# EAGLE design O2 (EAGLE 7.2.0)
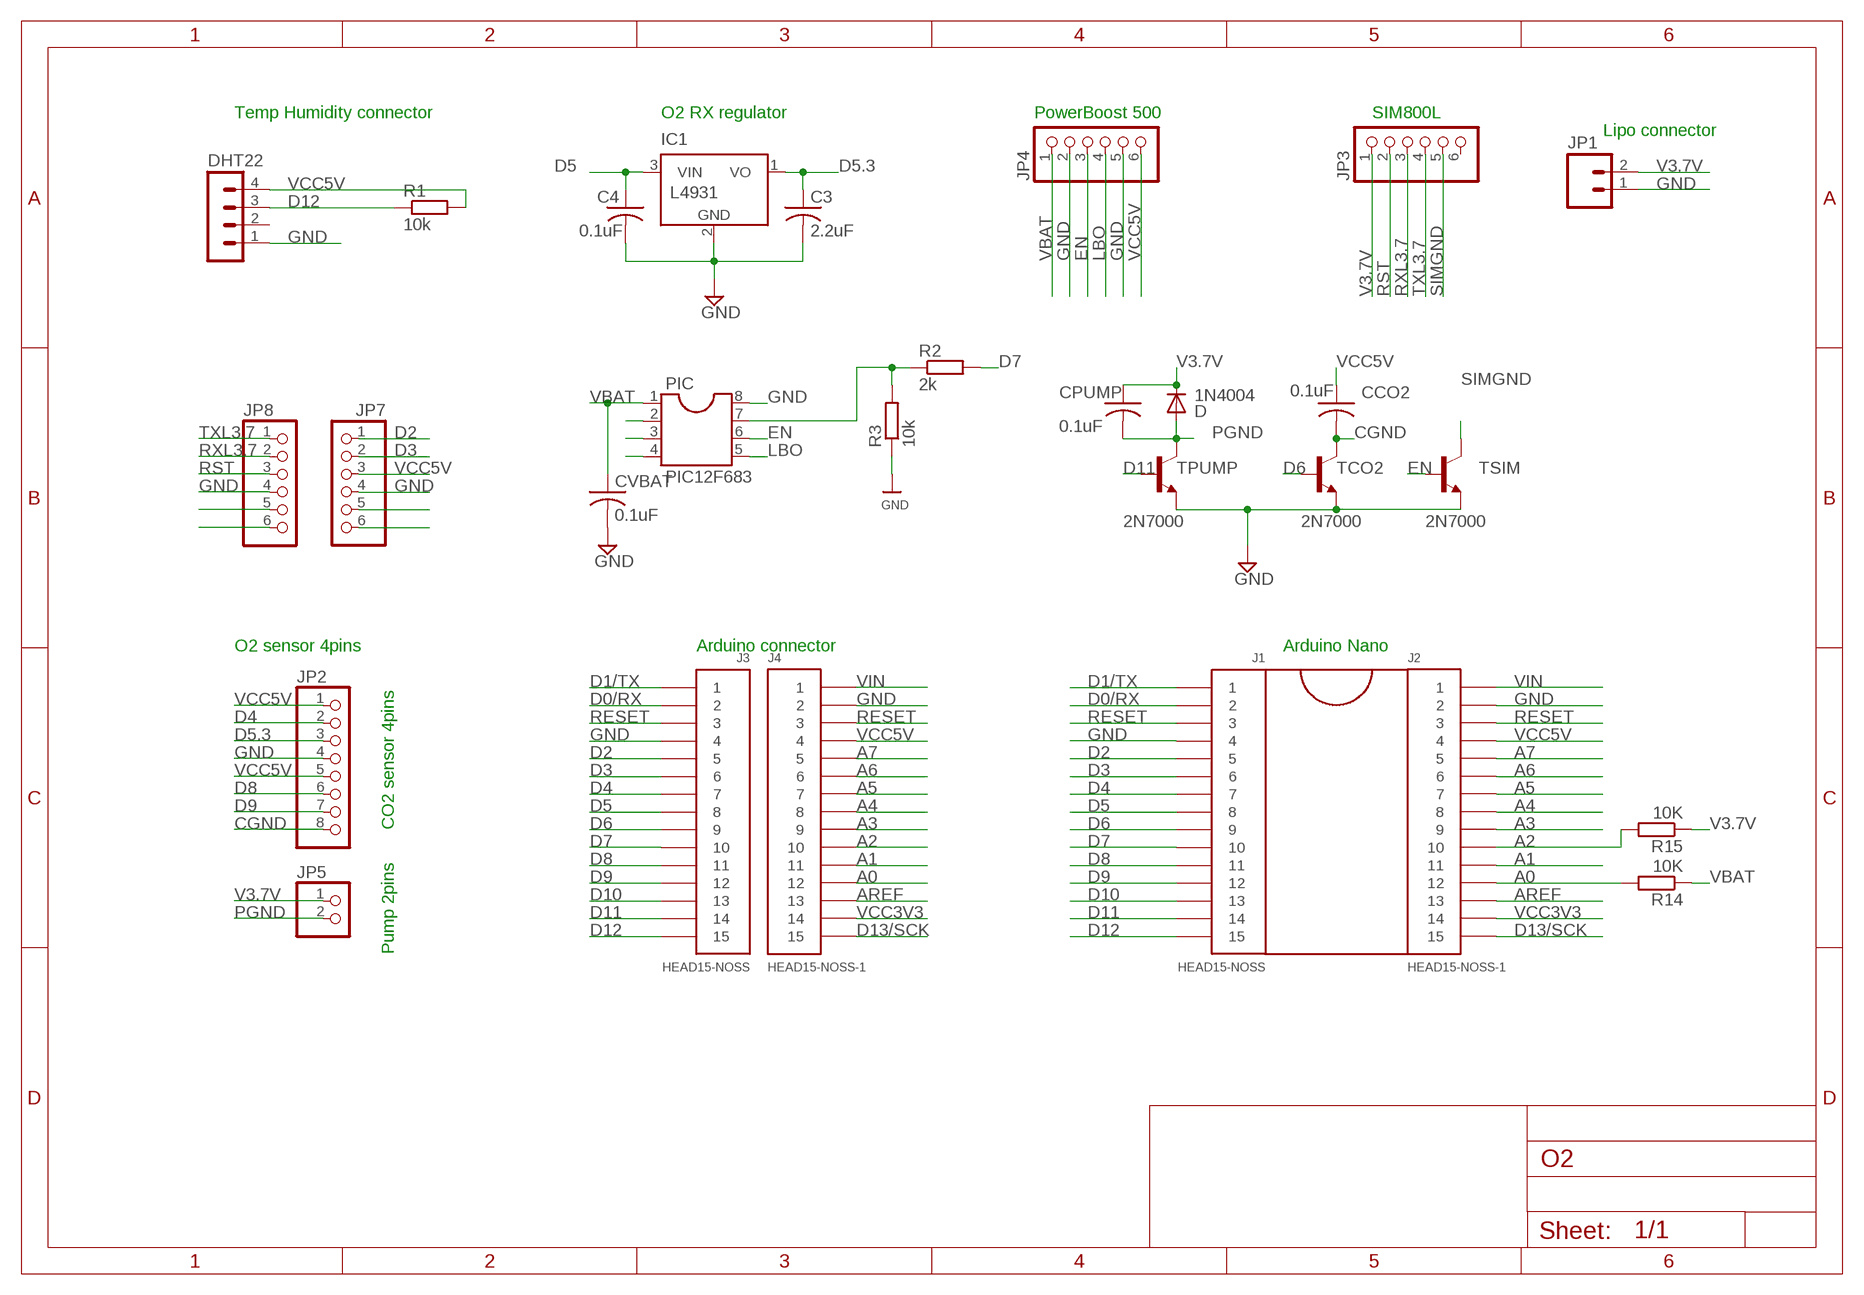
[diagram p0: schematic, sheet 1]

## Parts
C3  2.2uF  C-US025-030X050  [C025-030X050]
C4  0.1uF  C-US025-030X050  [C025-030X050]
CCO2  0.1uF  C-US025-030X050  [C025-030X050]
CPUMP  0.1uF  C-US025-030X050  [C025-030X050]
CVBAT  0.1uF  C-US025-030X050  [C025-030X050]
D  1N4004  [DO41-10]
DHT22  MA04-1  [MA04-1]
IC1  L4931  LM2936Z-3.3  [TO92]
J1  HEAD15-NOSS  [HEAD15-NOSS]
J2  HEAD15-NOSS-1  [HEAD15-NOSS-1]
J3  HEAD15-NOSS  [HEAD15-NOSS]
J4  HEAD15-NOSS-1  [HEAD15-NOSS-1]
JP1  M023.5MM  [SCREWTERMINAL-3.5MM-2]
JP2  PINHD-1X8BIG  [1X08-BIG]
JP3  PINHD-1X6CB  [1X06-CLEANBIG]
JP4  PINHD-1X6CB  [1X06-CLEANBIG]
JP5  PINHD-1X2  [1X02]
JP7  PINHD-1X6CB  [1X06-CLEANBIG]
JP8  PINHD-1X6CB  [1X06-CLEANBIG]
PIC  PIC12F683  DIL8S  [SOCKET-08]
R1  10k  R-EU_0204/5  [0204/5]
R2  2k  R-EU_0204/5  [0204/5]
R3  10k  R-EU_0204/5  [0204/5]
R14  10K  R-EU_0204/5  [0204/5]
R15  10K  R-EU_0204/5  [0204/5]
TCO2  2N7000  2N2222  [TO92-EBC-OVAL]
TPUMP  2N7000  2N2222  [TO92-EBC-OVAL]
TSIM  2N7000  2N2222  [TO92-EBC-OVAL]

## Nets
A0: J2.12 J4.12 R14.2
A1: J2.11 J4.11
A2: J2.10 J4.10 R15.2
A3: J2.9 J4.9
A4: J2.8 J4.8
A5: J2.7 J4.7
A6: J2.6 J4.6
A7: J2.5 J4.5
AREF: J2.13 J4.13
CGND: CCO2.2 JP2.8 TCO2.C
D0/RX: J1.2 J3.2
D1/TX: J1.1 J3.1
D2: J1.5 J3.5 JP7.1
D3: J1.6 J3.6 JP7.2
D4: J1.7 J3.7 JP2.2
D5: C4.1 IC1.3(VIN) J1.8 J3.8
D5.3: C3.1 IC1.1(VO) JP2.3
D6: J1.9 J3.9 TCO2.B
D7: J1.10 J3.10 R2.2
D8: J1.11 J3.11 JP2.6
D9: J1.12 J3.12 JP2.7
D10: J1.13 J3.13
D11: J1.14 J3.14 TPUMP.B
D12: DHT22.3 J1.15 J3.15 R1.1
D13/SCK: J2.15 J4.15
EN: JP4.3 PIC.6 TSIM.B
GND: C3.2 C4.2 CVBAT.2 DHT22.1 IC1.2(GND) J1.4 J2.2 J3.4 J4.2 JP1.1 JP2.4 JP4.2 JP4.5 JP7.4 JP8.4 PIC.8 R3.1 TCO2.E TPUMP.E TSIM.E
LBO: JP4.4 PIC.5
N$3: JP8.5
N$4: JP8.6
N$15: JP7.5
N$16: JP7.6
N$24: PIC.2
N$25: PIC.3
N$26: PIC.4
N$29: PIC.7 R2.1 R3.2
PGND: CPUMP.2 D.A JP5.2 TPUMP.C
RESET: J1.3 J2.3 J3.3 J4.3
RST: JP3.2 JP8.3
RXL3.7: JP3.3 JP8.2
SIMGND: JP3.5 TSIM.C
TXL3.7: JP3.4 JP8.1
V3.7V: CPUMP.1 D.C JP1.2 JP3.1 JP5.1 R15.1
VBAT: CVBAT.1 JP4.1 PIC.1 R14.1
VCC3V3: J2.14 J4.14
VCC5V: CCO2.1 DHT22.4 J2.4 J4.4 JP2.1 JP2.5 JP4.6 JP7.3 R1.2
VIN: J2.1 J4.1
Unconnected: DHT22.2 JP3.6

## Notes on the sheet
- Temp Humidity connector | O2 RX regulator | PowerBoost 500 | SIM800L
- Lipo connector
- O2 sensor 4pins | Arduino connector | Arduino Nano
- CO2 sensor 4pins
- Pump 2pins

## Library data of the parts
C3 C4 CCO2 CPUMP CVBAT = adafruit:C-US: CAPACITOR, American symbol
D = diode:1N4004: DIODE general purpose rectifier, 1 A
DHT22 = con-lstb:MA04-1: PIN HEADER; OC_FARNELL: unknown; OC_NEWARK: unknown
IC1 = national-semiconductor:LM2936?*: Ultra-Low Quiescent Current LDO Voltage Regulator Source: Data sheet <http://www.national.com/ds/LM/LM2936.pdf>; MF: NATIONAL SEMICONDUCTOR; MPN: LM2936Z-3.3/NOPB; OC_FARNELL: 1564641; OC_NEWARK: 41K4532
J1 J3 = MyCON2:HEAD15-NOSS
J2 J4 = MyCON2:HEAD15-NOSS-1
JP1 = SparkFun-Connectors:M02: Standard 2-pin 0.1" header. Use with - straight break away headers ( PRT-00116) - right angle break away headers (PRT-00553) - swiss pins (PRT-00743) - machine pins (PRT-00117) - female headers (PRT-00115) Molex polarized connector foot print use with: PRT-08233 with associated crimp pins and housings. 2.54_SCREWTERM for use with PRT-10571. 3.5mm Screw Terminal footprints for PRT-08084 5mm Screw Terminal footprints for use with PRT-08432; PROD_ID: CONN-08399
JP2 = adafruit:PINHD-1X8: PIN HEADER
JP3 JP4 JP7 JP8 = adafruit:PINHD-1X6: PIN HEADER
JP5 = pinhead:PINHD-1X2: PIN HEADER
PIC = ic-package:DIL8: Dual In Line / Socket
R1-R3 R14 R15 = resistor:R-EU_: RESISTOR, European symbol
TCO2 TPUMP TSIM = adafruit:2N2222: NPN TRANSISTOR Big oval pads

## Board
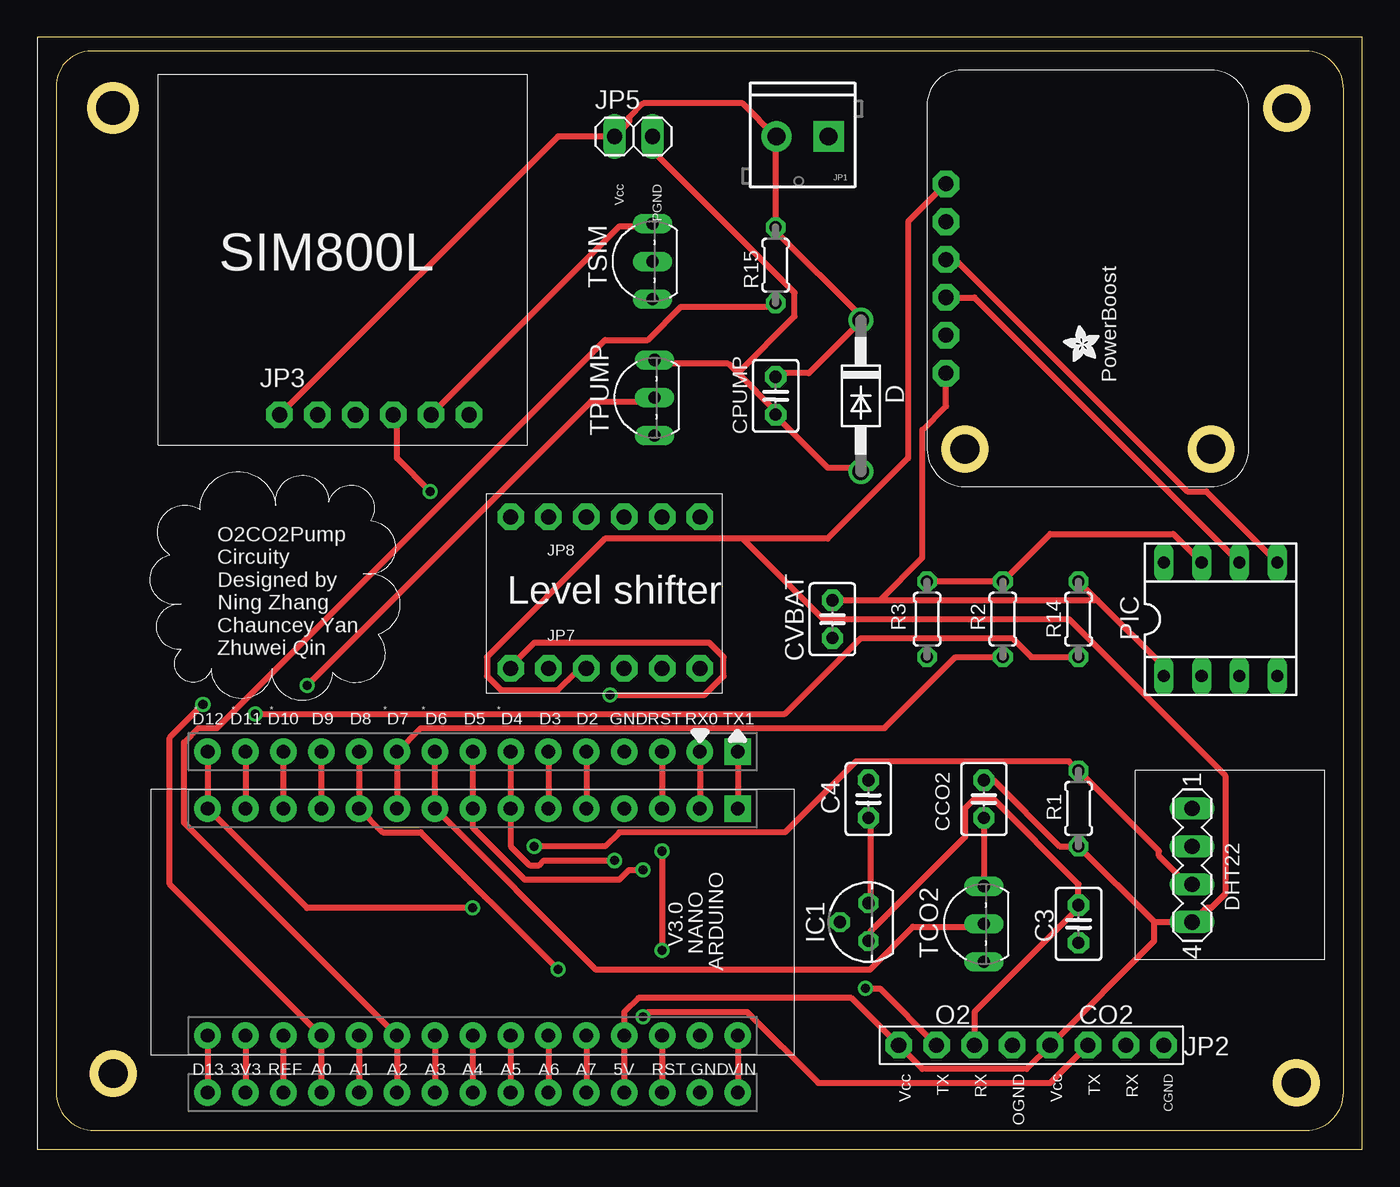
[diagram p1: board, top side]
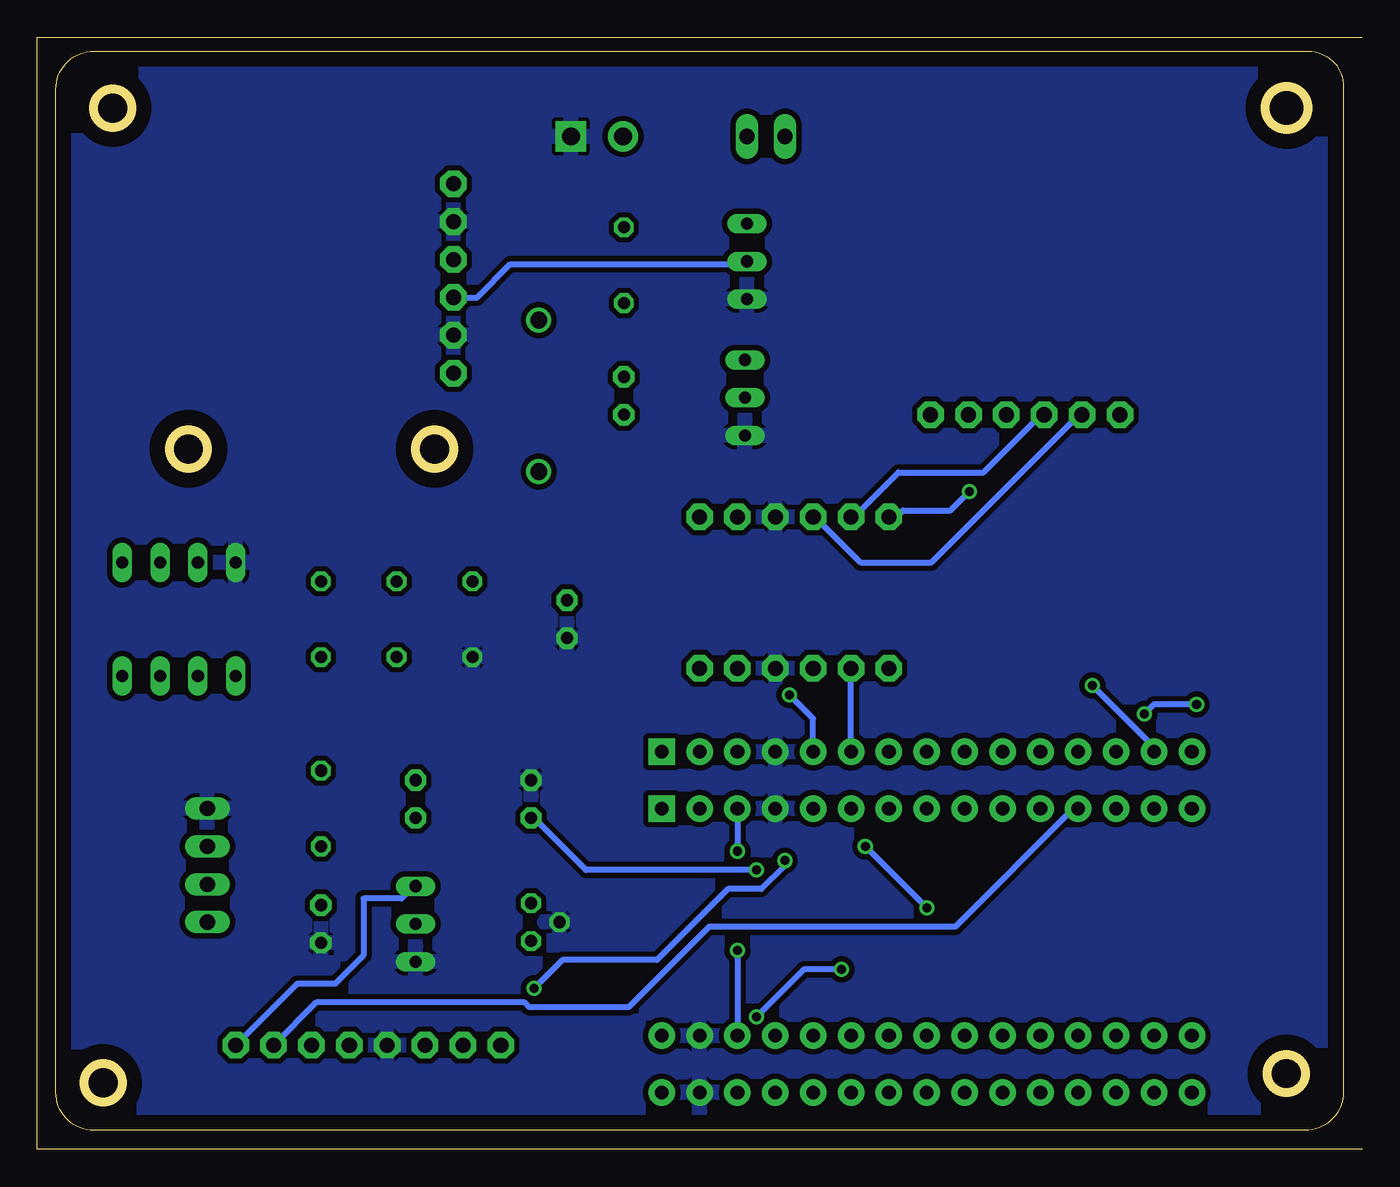
[diagram p2: board, bottom side, seen from below]

Size 88.88 x 74.6 mm. Coordinates in mm from the lower left corner, seen from the top.
Outline: 0,0 88.88,0 88.88,74.6 0,74.6
Outline: 85.09,73.66 3.81,73.66 arc90 1.27,71.5 1.27,3.81 arc90 3.81,1.27 85.09,1.27 arc90 87.63,3.81 87.63,71.12
Outline: 87.63,71.12 arc90 85.09,73.66
Outline: 87.63,71.12 arc90 85.09,73.66
Outline: circle at 84.45,4.45 radius 1.27
Outline: circle at 5.08,5.08 radius 1.27
Outline: circle at 62.23,46.99 radius 1.27
Outline: circle at 78.74,46.99 radius 1.27
Outline: circle at 83.82,69.85 radius 1.27
Outline: circle at 5.08,69.85 radius 1.42
Copper layers (1*16): Top 0.035mm / dielectric 1.5mm / Bottom 0.035mm
Design rules "default *": minimum track width 16mil, minimum drill 24mil, track to track 14mil, track to pad 14mil, pad to pad 14mil, via to via 14mil, smd to smd 14mil, copper to edge 40mil, drill to drill 14mil, minimum pad ring 10mil, minimum via ring 8mil, stop-mask expansion 4mil, vias tented up to drill 0mil, thermal gap 10mil

### Footprints (pad centres in the part's own frame; a part is rotated, then mirrored left to right if it is on the bottom)
C025-030X050 = drill 0.813 pad 1.422 octagon: 1 -1.27,0; 2 1.27,0
DO41-10 = drill 1.118: A 5.08,0; C -5.08,0
MA04-1 = drill 1.016 long: 1 -3.81,0; 2 -1.27,0; 3 1.27,0; 4 3.81,0
TO92 = drill 0.813 pad 1.27 octagon: 1 -1.27,0; 2 0,1.905; 3 1.27,0
HEAD15-NOSS = drill 0.914 pad 1.778 square: 1 0,0 | drill 0.914 pad 1.778: 2 2.54,0; 3 5.08,0; 4 7.62,0; 5 10.16,0; 6 12.7,0; 7 15.24,0; 8 17.78,0; 9 20.32,0; 10 22.86,0; 11 25.4,0; 12 27.94,0; 13 30.48,0; 14 33.02,0; 15 35.56,0
HEAD15-NOSS-1 = drill 0.914 pad 1.778: 1 0,0; 2 2.54,0; 3 5.08,0; 4 7.62,0; 5 10.16,0; 6 12.7,0; 7 15.24,0; 8 17.78,0; 9 20.32,0; 10 22.86,0; 11 25.4,0; 12 27.94,0; 13 30.48,0; 14 33.02,0; 15 35.56,0
SCREWTERMINAL-3.5MM-2 = drill 1.2 pad 2.032 square: 1 0,0 | drill 1.2 pad 2.032: 2 3.5,0
1X08-BIG = drill 1.016 pad 1.778 octagon: 1 -8.89,0; 2 -6.35,0; 3 -3.81,0; 4 -1.27,0; 5 1.27,0; 6 3.81,0; 7 6.35,0; 8 8.89,0
1X06-CLEANBIG = drill 1.016 pad 1.778 octagon: 1 -6.35,0; 2 -3.81,0; 3 -1.27,0; 4 1.27,0; 5 3.81,0; 6 6.35,0
1X02 = drill 1.016 long: 1 -1.27,0; 2 1.27,0
SOCKET-08 = drill 0.813 long: 1 -3.81,-3.81; 2 -1.27,-3.81; 3 1.27,-3.81; 4 3.81,-3.81; 5 3.81,3.81; 6 1.27,3.81; 7 -1.27,3.81; 8 -3.81,3.81
0204/5 = drill 0.813 octagon: 1 -2.54,0; 2 2.54,0
TO92-EBC-OVAL = drill 0.813 long: B 0,-1.27; C 2.54,-1.27; E -2.54,-1.27

### Placement (x,y rotation side)
C3  69.85,15.11 270 top
C4  55.75,23.5 90 top
CCO2  63.5,23.5 270 top
CPUMP  49.53,50.55 270 top
CVBAT  53.34,35.56 270 top
D  55.24,50.55 270 top
DHT22  77.47,19.05 270 top
IC1  55.75,15.24 90 top
J1  46.99,22.86 180 top
J2  46.99,7.62 180 top
J3  46.99,26.67 180 top
J4  46.99,3.81 180 top
JP1  53.09,67.94 180 top
JP2  66.67,6.99 0 top
JP3  22.61,49.28 0 top
JP4  60.96,58.42 90 top
JP5  40.01,67.94 0 top
JP7  38.1,32.26 0 top
JP8  38.1,42.42 0 top
PIC  79.38,35.56 0 top
R1  69.85,22.86 270 top
R2  64.77,35.56 270 top
R3  59.69,35.56 90 top
R14  69.85,35.56 270 top
R15  49.53,59.31 270 top
TCO2  62.23,15.11 90 top
TPUMP  40.13,50.42 90 top
TSIM  40.01,59.56 90 top
U$34  [ADAFRUIT_2.5MM]  71.25,52.83 90 top

### Tracks (layer width: path | path; a pad name or v marks a point on that pad's centre or on a via)
A0  (via drill 0.61)
  Top 0.406: R14.2 66.67,33.02 65.41,34.29 55.24,34.29 50.16,29.21 v14.61,29.21 | v11.11,29.84 8.89,27.62 8.89,17.78 J2.12 J4.12
  Bottom 0.406: v14.61,29.21 13.97,29.84 v11.11,29.84
A1
  Top 0.406: J2.11 J4.11
A2
  Top 0.406: R15.2 49.53,56.52 43.18,56.52 40.96,54.29 38.1,54.29 12.06,28.26 10.79,28.26 9.84,27.3 9.84,21.91 J2.10 J4.10
A3
  Top 0.406: J2.9 J4.9
A4
  Top 0.406: J2.8 J4.8
A5
  Top 0.406: J2.7 J4.7
A6
  Top 0.406: J2.6 J4.6
A7
  Top 0.406: J2.5 J4.5
AREF
  Top 0.406: J2.13 J4.13
CGND
  Top 0.406: CCO2.2 TCO2.C
  Bottom 0.406: JP2.8 71.44,11.11 68.9,11.11 66.99,13.02 66.99,16.83 64.45,16.83 63.82,17.46 63.5,17.46 TCO2.C
D0/RX
  Top 0.406: J3.2 J1.2
D1/TX
  Top 0.406: J3.1 J1.1
D2  (via drill 0.61)
  Top 0.406: J3.5 J1.5 | v38.42,30.48 44.77,30.48 46.04,31.75 46.04,33.02 45.09,33.97 33.34,33.97 31.75,32.38 JP7.1
  Bottom 0.406: v38.42,30.48 36.83,28.89 J3.5
D3
  Top 0.406: J3.6 J1.6
  Bottom 0.406: J3.6 JP7.2
D4  (via drill 0.61)
  Top 0.406: J3.7 J1.7 31.75,20.32 33.02,19.05 33.66,19.05 33.97,19.37 v38.73,19.37 | JP2.2 56.52,10.79 v55.56,10.79
  Bottom 0.406: v55.56,10.79 53.66,12.7 47.31,12.7 42.55,17.46 40.32,17.46 38.73,19.05 v38.73,19.37
D5  (via drill 0.61)
  Top 0.406: IC1.3 55.88,16.51 55.88,22.23 C4.1 | J3.8 J1.8 29.21,21.59 32.7,18.1 39.05,18.1 39.69,18.73 v40.64,18.73
  Bottom 0.406: v40.64,18.73 52.07,18.73 55.56,22.23 C4.1
D5.3
  Top 0.406: IC1.1 55.88,13.97 55.88,14.61 62.23,20.95 62.23,22.86 62.87,23.5 64.14,23.5 69.85,17.78 C3.1 69.85,16.19 62.87,9.21 JP2.3
D6
  Top 0.406: TCO2.B 63.5,14.92 58.74,14.92 55.88,12.06 37.47,12.06 J1.9 J3.9
D7
  Top 0.406: R2.2 61.59,33.02 56.83,28.26 25.72,28.26 J3.10 J1.10
D8  (via drill 0.61)
  Top 0.406: J3.11 J1.11 23.18,21.27 25.72,21.27 v34.92,12.06 | JP2.6 67.94,4.45 52.39,4.45 47.62,9.21 40.96,9.21 v40.64,8.89
  Bottom 0.406: v40.64,8.89 37.47,12.06 v34.92,12.06
D9
  Top 0.406: J3.12 J1.12
  Bottom 0.406: JP2.7 70.17,9.84 56.2,9.84 55.88,9.53 49.21,9.53 43.81,14.92 27.3,14.92 19.37,22.86 J1.12
D10
  Top 0.406: J3.13 J1.13
D11  (via drill 0.61)
  Top 0.406: v18.1,31.11 37.15,50.16 41.27,50.16 TPUMP.B | J3.14 J1.14
  Bottom 0.406: v18.1,31.11 13.97,26.99 J3.14
D12  (via drill 0.61)
  Top 0.406: J3.15 J1.15 18.1,16.19 v29.21,16.19 | DHT22.3 77.15,17.78 75.25,19.68 75.25,20 R1.1 69.22,26.04 54.93,26.04 50.16,21.27 39.05,21.27 38.1,20.32 v33.34,20.32
  Bottom 0.406: v33.34,20.32 v29.21,16.19
D13/SCK
  Top 0.406: J2.15 J4.15
EN
  Top 0.406: PIC.6 62.87,57.15 JP4.3
  Bottom 0.406: JP4.3 59.37,57.15 57.15,59.37 41.27,59.37 TSIM.B
GND
  pour Bottom: -2.29,76.96 91.44,76.96 91.44,-2.29 -2.29,-2.29
LBO
  Top 0.406: PIC.5 78.42,44.13 77.15,44.13 61.59,59.69 JP4.4
N$29
  Top 0.406: R3.2 R2.1 67.94,41.27 76.2,41.27 PIC.7
PGND
  Top 0.406: 46.99,52.07 49.53,49.53 CPUMP.2 49.53,49.21 53.02,45.72 55.24,45.72 D.A | 46.99,52.07 46.35,52.7 41.59,52.7 TPUMP.C | JP5.2 41.27,66.99 50.8,57.47 50.8,55.88 46.99,52.07
RESET  (via drill 0.61)
  Top 0.406: J2.3 J4.3 | J3.3 J1.3 | v41.91,20 v41.91,13.34
  Bottom 0.406: v41.91,13.34 J2.3 | J1.3 v41.91,20
RST
  Bottom 0.406: JP3.2 19.05,49.21 28.89,39.37 33.66,39.37 36.51,42.23 36.83,42.23 JP8.3
RXL3.7
  Bottom 0.406: JP3.3 21.59,49.21 25.4,45.4 31.11,45.4 33.97,42.55 34.29,42.55 JP8.2
SIMGND
  Top 0.406: JP3.5 39.05,61.91 41.27,61.91 TSIM.C
TXL3.7  (via drill 0.61)
  Top 0.406: v26.35,44.13 24.13,46.35 24.13,49.21 JP3.4
  Bottom 0.406: v26.35,44.13 27.62,42.86 30.8,42.86 31.11,42.55 31.75,42.55 JP8.1
V3.7V
  Top 0.406: CPUMP.1 49.53,52.07 51.75,52.07 55.24,55.56 D.C 55.24,55.88 49.53,61.59 R15.1 49.53,67.94 | 49.53,67.94 47.31,70.17 40.64,70.17 39.69,69.22 39.69,68.9 JP5.1 34.92,67.94 JP3.1 | 49.53,67.94 JP1.2
VBAT
  Top 0.406: PIC.1 75.56,32.38 71.12,36.83 | R14.1 71.12,36.83 | 71.12,36.83 56.52,36.83 | 56.52,36.83 CVBAT.1 | JP4.1 60.96,49.85 59.37,48.26 59.37,39.69 56.52,36.83
VCC3V3
  Top 0.406: J2.14 J4.14
VCC5V
  Top 0.406: CCO2.1 64.14,24.77 68.58,20.32 R1.2 74.93,15.24 | 74.93,15.24 DHT22.4 78.42,16.19 78.74,16.19 79.69,17.14 79.69,25.08 69.22,35.56 52.7,35.56 47.31,40.96 | J4.4 J2.4 39.37,9.21 40.32,10.16 54.61,10.16 JP2.1 59.37,5.4 66.36,5.4 JP2.5 74.93,13.97 74.93,15.24 | 47.31,40.96 53.02,40.96 58.42,46.35 58.42,62.23 JP4.6 | 47.31,40.96 38.1,40.96 30.16,33.02 30.16,31.75 31.11,30.8 34.92,30.8 36.2,32.07 36.83,32.07 JP7.3
VIN
  Top 0.406: J2.1 J4.1

### Text on the board
tPlace: Vcc | PGND | PowerBoost | O2CO2Pump / Circuity / Designed by / Ning Zhang / Chauncey Yan / Zhuwei Qin | * | * | * | * | * | * | D12 | D11 | D10 | D9 | D8 | D7 | D6 | D5 | D4 | D3 | D2 | GND | RST | RX0 | TX1 | ARDUINO | V3.0 | NANO | D13 | 3V3 | REF | A0 | A1 | A2 | A3 | A4 | A5 | A6 | A7 | 5V | RST | GND | VIN | Vcc | TX | RX | OGND | Vcc | TX | RX | CGND
tNames: SIM800L | Level shifter | O2 | CO2